# EAGLE schematic main (EAGLE 9.2.0)
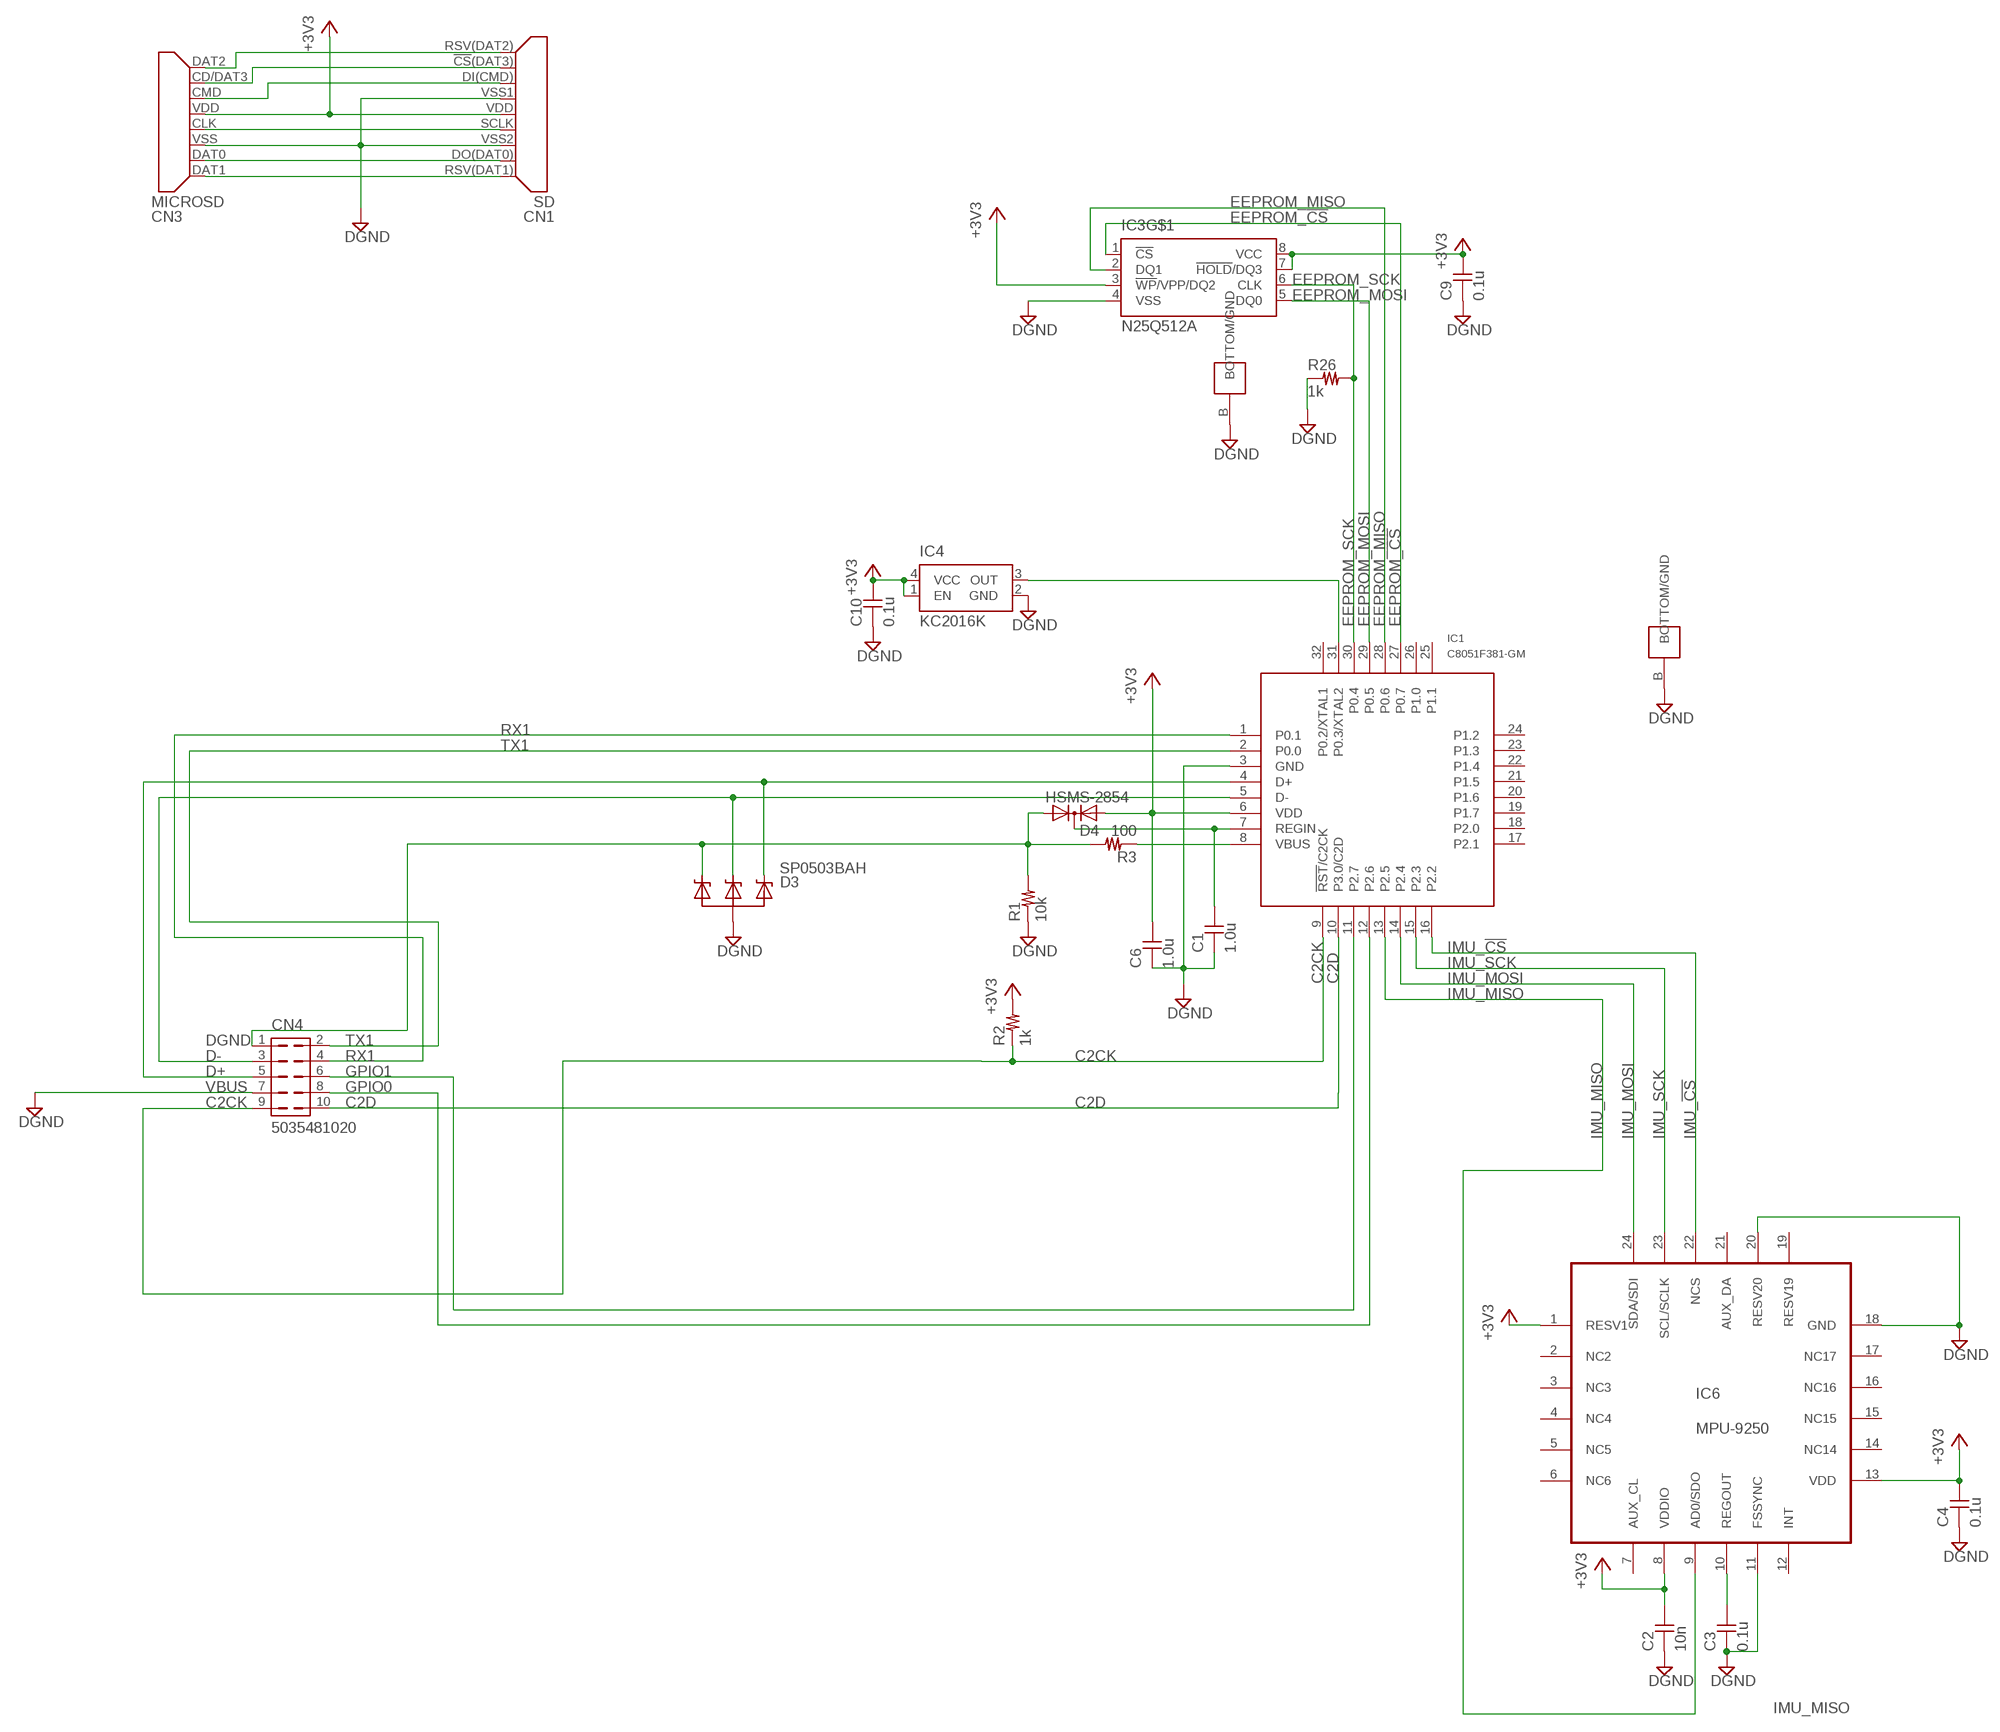
[diagram p0: schematic, sheet 1]

## Parts
C1  1.0u  C-1005  [1005]
C2  10n  C-1005  [1005]
C3  0.1u  C-1005  [1005]
C4  0.1u  C-1005  [1005]
C6  1.0u  C-1005  [1005]
C9  0.1u  C-1005  [1005]
C10  0.1u  C-1005  [1005]
CN1  SD  [SD_V3]
CN3  MICROSD  [BLOCK_SD_CONNECTOR]
CN4  5035481020  [5035481020]
D3  SP0503BAH  [SOT143]
D4  HSMS-2854  [SOT23]
IC1  C8051F381-GM  [QFN32]
IC3  N25Q512A  [V-PDFN-8]
IC4  KC2016K  [KC2016K]
IC6  MPU-9250  [QFN-24]
R1  10k  R-1005  [1005]
R2  1k  R-1005  [1005]
R3  100  R-1005  [1005]
R26  1k  R-1005  [1005]

## Nets
+3V3 [power]: C2.P$2 C4.P$2 C6.P$2 C9.P$2 C10.P$2 CN1.VDD CN3.VDD D4.2(A2) IC1.6(VDD) IC3.3(!WP!/VPP/DQ2) IC3.7(!HOLD!/DQ3) IC3.8(VCC) IC4.1(EN) IC4.4(VCC) IC6.1(RESV1) IC6.8(VDDIO) IC6.13(VDD) R2.P$2
C2CK: CN4.9 IC1.9(!RST!/C2CK) R2.P$1
C2D: CN4.10 IC1.10(P3.0/C2D)
D+: CN4.5 D3.2 IC1.4(D+)
D-: CN4.3 D3.3 IC1.5(D-)
DGND [power]: C1.P$1 C2.P$1 C3.P$1 C4.P$1 C6.P$1 C9.P$1 C10.P$1 CN1.VSS1 CN1.VSS2 CN3.VSS CN4.7 D3.1 IC1.3(GND) IC1.B(BOTTOM/GND) IC3.4(VSS) IC3.B(BOTTOM/GND) IC4.2(GND) IC6.11(FSSYNC) IC6.18(GND) IC6.20(RESV20) R1.P$1 R26.P$1
EEPROM_!CS: IC1.27(P0.7) IC3.1(!CS)
EEPROM_MISO: IC1.28(P0.6) IC3.2(DQ1)
EEPROM_MOSI: IC1.29(P0.5) IC3.5(DQ0)
EEPROM_SCK: IC1.30(P0.4) IC3.6(CLK) R26.P$2
GPIO0: CN4.8 IC1.12(P2.6)
GPIO1: CN4.6 IC1.11(P2.7)
IMU_!CS: IC1.16(P2.2) IC6.22(NCS)
IMU_MISO: IC1.13(P2.5) IC6.9(AD0/SDO)
IMU_MOSI: IC1.14(P2.4) IC6.24(SDA/SDI)
IMU_SCK: IC1.15(P2.3) IC6.23(SCL/SCLK)
N$1 [power]: C1.P$2 D4.3(C) IC1.7(REGIN)
N$2: CN1.RSV(DAT1) CN3.DAT1
N$3: CN1.DO(DAT0) CN3.DAT0
N$4: IC1.8(VBUS) R3.P$1
N$6: CN1.SCLK CN3.CLK
N$10: CN1.DI(CMD) CN3.CMD
N$11: IC1.31(P0.3/XTAL2) IC4.3(OUT)
N$12: CN1.!CS!(DAT3) CN3.CD/DAT3
N$13: C3.P$2 IC6.10(REGOUT)
N$14: CN1.RSV(DAT2) CN3.DAT2
RX1: CN4.4 IC1.1(P0.1)
TX1: CN4.2 IC1.2(P0.0)
VBUS [power]: CN4.1 D3.4 D4.1(A1) R1.P$2 R3.P$2
Unconnected: IC1.17(P2.1) IC1.18(P2.0) IC1.19(P1.7) IC1.20(P1.6) IC1.21(P1.5) IC1.22(P1.4) IC1.23(P1.3) IC1.24(P1.2) IC1.25(P1.1) IC1.26(P1.0) IC1.32(P0.2/XTAL1) IC6.2(NC2) IC6.3(NC3) IC6.4(NC4) IC6.5(NC5) IC6.6(NC6) IC6.7(AUX_CL) IC6.12(INT) IC6.14(NC14) IC6.15(NC15) IC6.16(NC16) IC6.17(NC17) IC6.19(RESV19) IC6.21(AUX_DA)

## Library data of the parts
C1-C4 C6 C9 C10 = reg,cap:C-
CN1 = Connector:SD
CN3 = Connector:MICROSD
CN4 = Connector:5035481020
D3 = diode:SP0503BAH
D4 = avago:HSMS-2854: Surface Mount Microwave Schottky Detector Diodes Source: Data sheet <http://www.farnell.com/datasheets/461166.pdf>
IC1 = C8051F34x:C8051F381-GM
IC3 = EEPROM:N25Q512A
IC4 = Oscillator:KC2016K
IC6 = GYRO:MPU-9250
R1-R3 R26 = reg,cap:R-

## Net classes
0 signal: width 0.152 mm
1 power: width 0.203 mm